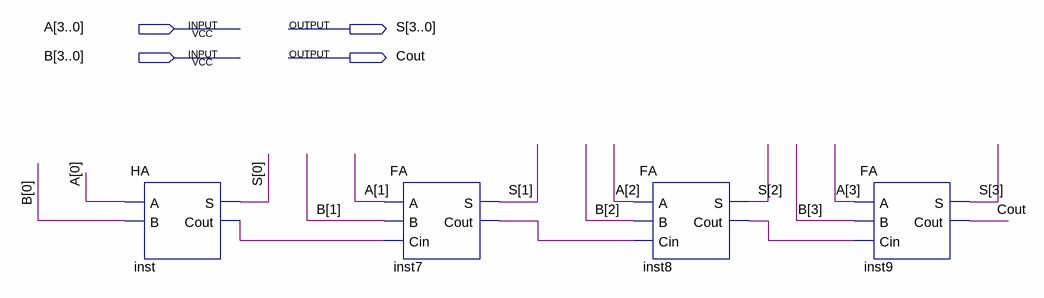
[diagram p0: schematic sheet]
// Quartus schematic Somador.bdf as structural Verilog: 4 symbols, 4 pins
module Somador (
  input  [3:0] A,
  input  [3:0] B,
  output [3:0] S,
  output Cout
);

  wire inst7_cout, inst8_cout, inst_cout;

  HA inst (.A(A[0]), .B(B[0]), .S(S[0]), .Cout(inst_cout));
  FA inst7 (.A(A[1]), .B(B[1]), .Cin(inst_cout), .S(S[1]), .Cout(inst7_cout));
  FA inst8 (.A(A[2]), .B(B[2]), .Cin(inst7_cout), .S(S[2]), .Cout(inst8_cout));
  FA inst9 (.A(A[3]), .B(B[3]), .Cin(inst8_cout), .S(S[3]), .Cout(Cout));
endmodule
